# Altium schematic sheet Power_System.SchDoc: Vacuum chamber sensorboard - Power and reference
size A4; SheetNumber: 5; SheetTotal: 6
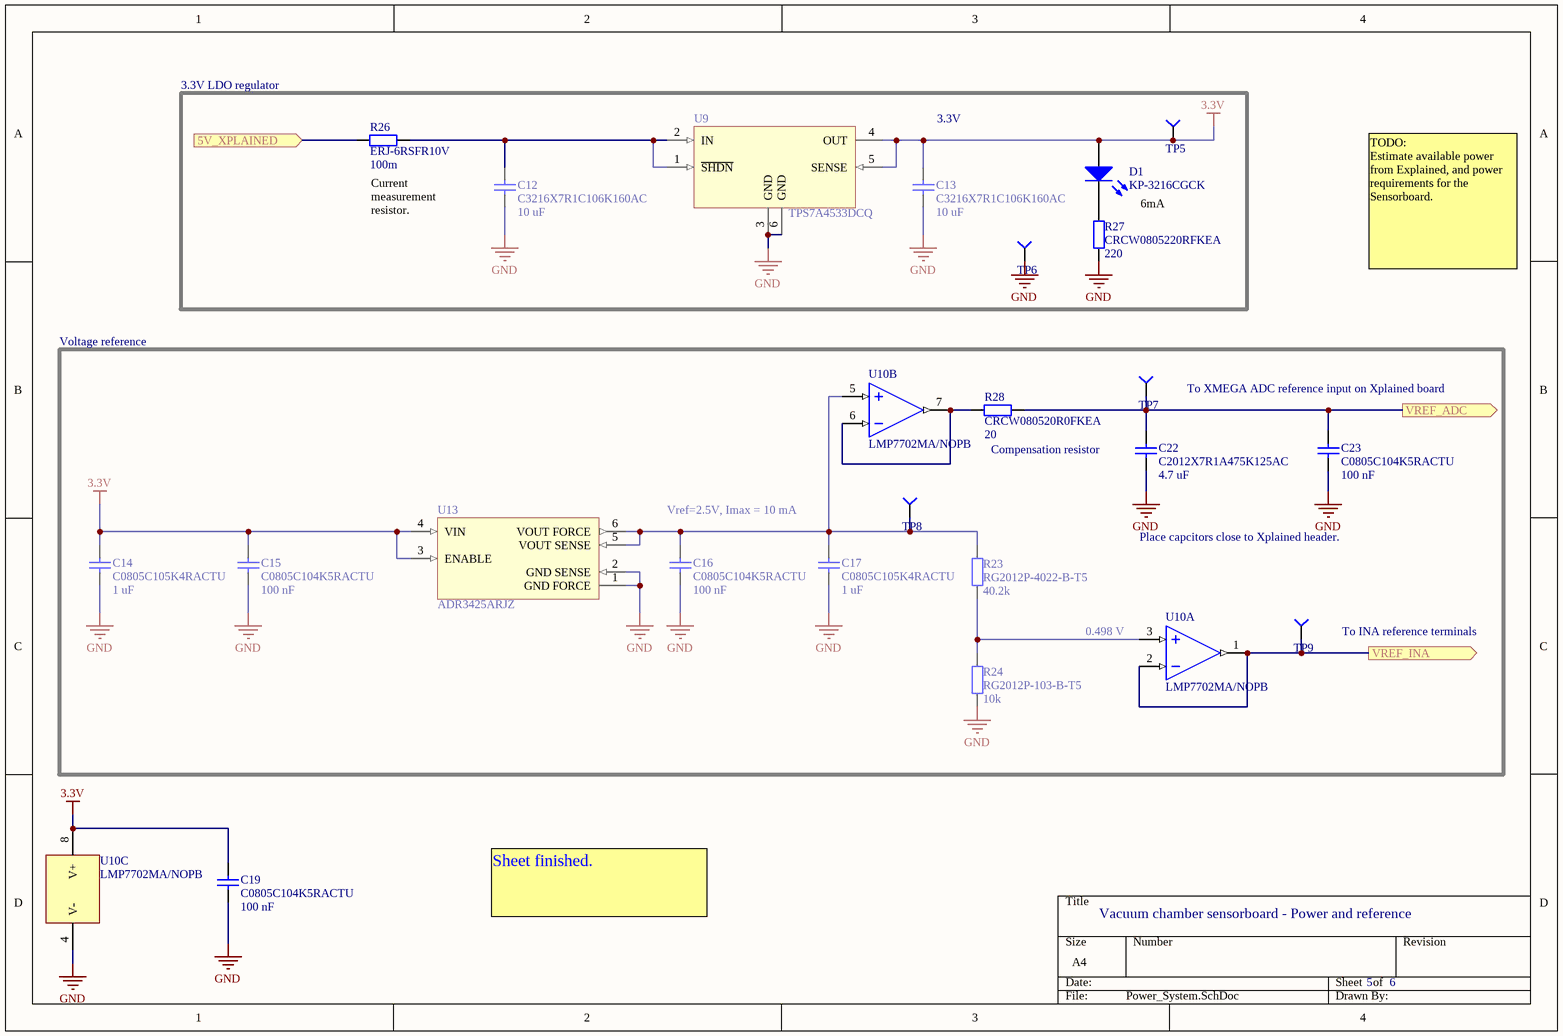
[diagram p0: Power_System.SchDoc]

## Parts
C12  C3216X7R1C106K160AC  value 10 uF  [Cap TDK1206]
C13  C3216X7R1C106K160AC  value 10 uF  [Cap TDK1206]
C14  C0805C105K4RACTU  value 1 uF  [Cap Kemet 0805]
C15  C0805C104K5RACTU  value 100 nF  [Cap Kemet 0805]
C16  C0805C104K5RACTU  value 100 nF  [Cap Kemet 0805]
C17  C0805C105K4RACTU  value 1 uF  [Cap Kemet 0805]
C19  C0805C104K5RACTU  value 100 nF  [Cap Kemet 0805]
C22  C2012X7R1A475K125AC  value 4.7 uF  [Cap TDK0805]
C23  C0805C104K5RACTU  value 100 nF  [Cap Kemet 0805]
D1  KP-3216CGCK  [Diode Kingbright]
R23  RG2012P-4022-B-T5  value 40.2k  [RES SSM 0805]
R24  RG2012P-103-B-T5  value 10k  [RES SSM 0805]
R26  ERJ-6RSFR10V  value 100m  [Res panasonic0805]
R27  CRCW0805220RFKEA  value 220  [Res Vishay0805]
R28  CRCW080520R0FKEA  value 20  [Res Vishay0805]
TP5  Test_point  [Testpoint]  (value not drawn)
TP6  Test_point  [Testpoint]  (value not drawn)
TP7  Test_point  [Testpoint]  (value not drawn)
TP8  Test_point  [Testpoint]  (value not drawn)
TP9  Test_point  [Testpoint]  (value not drawn)
U9  TPS7A4533DCQ  [TPS7A4533DCQ]
U10  LMP7702MA/NOPB  [OPA2333AIDR]  (parts A,B,C of 3)
U13  ADR3425ARJZ  [ADR3425]

## Ports
5V_XPLAINED (in), VREF_ADC (out), VREF_INA (out)

## Nets
3.3V: C13.2 C14.2 C15.2 C19.2 D1.1(A) TP5.0 U9.4(OUT) U9.5(SENSE) U10.8(V+) U13.3(ENABLE) U13.4(VIN)
GND: C12.1 C13.1 C14.1 C15.1 C16.1 C17.1 C19.1 C22.1 C23.1 R24.1 R27.1 TP6.0 U9.3(GND) U9.6(GND) U10.4(V-) U13.1(GND_FORCE) U13.2(GND_SENSE)
5V_XPLAINED: R26.1 ; port 5V_XPLAINED
VREF_ADC: C22.2 C23.2 R28.2 TP7.0 ; port VREF_ADC
VREF_INA: TP9.0 U10.1(OUT_A) U10.2(-IN_A) ; port VREF_INA
NetC12_2: C12.2 R26.2 U9.1(~{SHDN}) U9.2(IN)
NetC16_2: C16.2 C17.2 R23.2 TP8.0 U10.5(+IN_B) U13.5(VOUT_SENSE) U13.6(VOUT_FORCE)
NetD1_2: D1.2(K) R27.2
NetR23_1: R23.1 R24.2 U10.3(+IN_A)
NetR28_1: R28.1 U10.6(-IN_B) U10.7(OUT_B)

## Notes on the sheet
- 3.3V LDO regulator
- 3.3V
- (near R26) Current measurement resistor.
- 6mA
- TODO:
  Estimate available power from Explained, and power requirements for the Sensorboard.
- Voltage reference
- To XMEGA ADC reference input on Xplained board
- Vref=2.5V, Imax = 10 mA
- Compensation resistor
- Place capcitors close to Xplained header.
- (near U10) 0.498 V
- (near TP9) To INA reference terminals
- Sheet finished.

## Library data of the parts
C12 C13 = C3216X7R1C106K160AC: Ceramic capacitor, X7R, 10%, 16V; Manufacturer: TDK; ComponentLink1Description: Datasheet; ComponentLink1URL: http://www.mouser.com/ds/2/400/C3216X7R1C106K160AC-265314.pdf; PackageReference: 1206; Supplier 1: Mouser; Supplier Part Number 1: 810-C3216X7R1C106K; Supplier 2: Farnell; Supplier Part Number 2: 1907353
C14 C17 = C0805C105K4RACTU: Ceramic capacitor, X7R, 10%, 16V; Manufacturer: Kemet; ComponentLink1Description: Datasheet; ComponentLink1URL: http://www.kemet.com/kemet/web/homepage/kechome.nsf/vapubfiles/KEM_C1002_X7R_SMD.pdf/$file/KEM_C1002_X7R_SMD.pdf; PackageReference: 0805; Supplier 1: Mouser; Supplier Part Number 1: 80-C0805C105K4R; Supplier 2: Farnell; Supplier Part Number 2: 9227792
C15 C16 C19 C23 = C0805C104K5RACTU: Ceramic capacitor, X7R, 10%, 50V; Manufacturer: Kemet; ComponentLink1Description: Datasheet; ComponentLink1URL: http://www.kemet.com/kemet/web/homepage/kechome.nsf/vapubfiles/KEM_C1002_X7R_SMD.pdf/$file/KEM_C1002_X7R_SMD.pdf; PackageReference: 0805; Supplier 1: Mouser; Supplier Part Number 1: 80-C0805C104K5R; Supplier 2: Farnell; Supplier Part Number 2: 1414664
C22 = C2012X7R1A475K125AC: Ceramic capacitor, X7R, 10%, 10V; Manufacturer: TDK; ComponentLink1Description: Datasheet; ComponentLink1URL: http://product.tdk.com/capacitor/mlcc/en/documents/C2012X7R1A475K125AC.pdf; PackageReference: 0805; Supplier 1: Mouser; Supplier Part Number 1: 810-C2012X7R1A475K
D1 = KP-3216CGCK: Chip led lamp,green, 50mcd @ 20mA; pin to pad: 1>A 2>K; Manufacturer: Kingbright; ComponentLink1Description: Datasheet; ComponentLink1URL: http://www.farnell.com/datasheets/1683499.pdf; PackageReference: 3.2x1.6mm; Supplier 1: Farnell; Supplier Part Number 1: 2290333
R23 = RG2012P-4022-B-T5: Thin film resistor, 0.1%, 100mW; Manufacturer: Susumu; ComponentLink1Description: Datasheet; ComponentLink1URL: http://susumu-usa.com/pdf/RG_RM_RGH_DATASHEET.pdf; PackageReference: 0805; Supplier 1: Mouser; Supplier Part Number 1: 754-RG2012P-4022-BT5
R24 = RG2012P-103-B-T5: Thin film resistor, 0.1%, 100mW; Manufacturer: Susumu; ComponentLink1Description: Datasheet; ComponentLink1URL: http://susumu-usa.com/pdf/RG_RM_RGH_DATASHEET.pdf; PackageReference: 0805; Supplier 1: Mouser; Supplier Part Number 1: 754-RG2012P-103-B-T5
R26 = ERJ-6RSFR10V: Thick film resistor, 1%, 125mW; Manufacturer: Panasonic; ComponentLink1Description: Datasheet; ComponentLink1URL: http://industrial.panasonic.com/www-data/pdf/AOA0000/AOA0000CE3.pdf; PackageReference: 0805; Supplier 1: Mouser; Supplier Part Number 1: 667-ERJ-6RSFR10V; Supplier 2: Farnell; Supplier Part Number 2: 1717785
R27 = CRCW0805220RFKEA: Thick film resistor, 1%, 125mW; Manufacturer: Vishay; ComponentLink1Description: Datasheet; ComponentLink1URL: http://www.vishay.com/docs/20035/dcrcwe3.pdf; PackageReference: 0805; Supplier 1: Mouser; Supplier Part Number 1: 71-CRCW0805-220-E3
R28 = CRCW080520R0FKEA: Thick film resistor, 1%, 125mW; Manufacturer: Vishay; ComponentLink1Description: Datasheet; ComponentLink1URL: http://www.vishay.com/docs/20035/dcrcwe3.pdf; PackageReference: 0805; Supplier 1: Mouser; Supplier Part Number 1: 71-CRCW0805-20-E3
TP5-TP9 = Test_point: pin to pad: 0>1; ComponentLink1Description: Datasheet
U9 = TPS7A4533DCQ: LDO regulator, 3.3V, 1.5A; Manufacturer: Texas Instruments; PackageReference: SOT-223-6; ComponentLink1Description: Datasheet; ComponentLink1URL: http://www.ti.com/lit/ds/slvs720d/slvs720d.pdf; Supplier 1: Mouser; Supplier Part Number 1: 595-TPS7A4533DCQT
U10 = LMP7702MA/NOPB: Op. amp, dual, rail-to-rail, single supply; PackageReference: SOIC-8; ComponentLink1Description: Datasheet; ComponentLink1URL: http://www.ti.com/lit/ds/symlink/lmp7702.pdf; Supplier 1: Farnell; Supplier Part Number 1: 1651867
U13 = ADR3425ARJZ: Series voltage reference, 2.5V; Manufacturer: Analog Devices; PackageReference: SOT-23-6; ComponentLink1Description: Datasheet; ComponentLink1URL: http://www.analog.com/static/imported-files/data_sheets/ADR3412_ADR3420_ADR3425_ADR3430_ADR3433_ADR3440_ADR3450.pdf; Supplier 1: Mouser; Supplier Part Number 1: 584-ADR3425ARJZ-R7; Supplier 2: Farnell; Supplier Part Number 2: 1827384